# Altium schematic sheet CONNECTORS2.SchDoc
size A; SheetNumber: 4; SheetTotal: 7
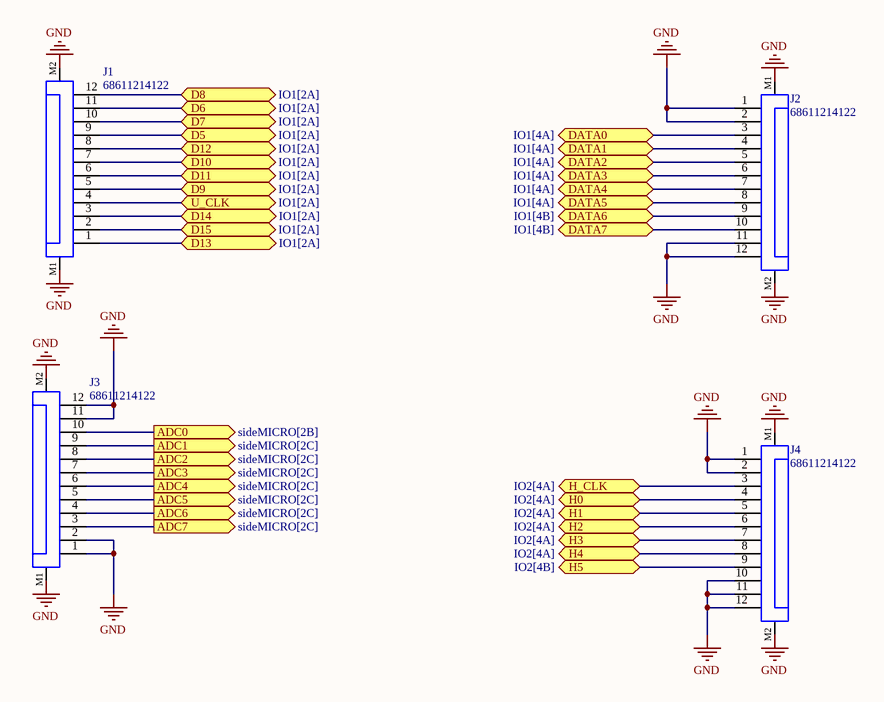
[diagram p0: CONNECTORS2.SchDoc]

## Parts
J1  68611214122  [68611214122]
J2  68611214122  [68611214122]
J3  68611214122  [68611214122]
J4  68611214122  [68611214122]

## Ports
ADC0 (out, see sideMICRO[2B]), ADC1 (out, see sideMICRO[2C]), ADC2 (out, see sideMICRO[2C]), ADC3 (out, see sideMICRO[2C]), ADC4 (out, see sideMICRO[2C]), ADC5 (out, see sideMICRO[2C]), ADC6 (out, see sideMICRO[2C]), ADC7 (out, see sideMICRO[2C]), D5 (bidir, see IO1[2A]), D6 (bidir, see IO1[2A]), D7 (bidir, see IO1[2A]), D8 (bidir, see IO1[2A]), D9 (bidir, see IO1[2A]), D10 (bidir, see IO1[2A]), D11 (bidir, see IO1[2A]), D12 (bidir, see IO1[2A]), D13 (bidir, see IO1[2A]), D14 (bidir, see IO1[2A]), D15 (bidir, see IO1[2A]), DATA0 (bidir, see IO1[4A]), DATA1 (bidir, see IO1[4A]), DATA2 (bidir, see IO1[4A]), DATA3 (bidir, see IO1[4A]), DATA4 (bidir, see IO1[4A]), DATA5 (bidir, see IO1[4A]), DATA6 (bidir, see IO1[4B]), DATA7 (bidir, see IO1[4B]), H0 (bidir, see IO2[4A]), H1 (bidir, see IO2[4A]), H2 (bidir, see IO2[4A]), H3 (bidir, see IO2[4A]), H4 (bidir, see IO2[4A]), H5 (bidir, see IO2[4B]), H_CLK (bidir, see IO2[4A]), U_CLK (bidir, see IO1[2A])

## Nets
GND: J1.M1 J1.M2 J2.1 J2.2 J2.11 J2.12 J2.M1 J2.M2 J3.1 J3.2 J3.11 J3.12 J3.M1 J3.M2 J4.1 J4.2 J4.10 J4.11 J4.12 J4.M1 J4.M2
ADC0: J3.10 ; port ADC0
ADC1: J3.9 ; port ADC1
ADC2: J3.8 ; port ADC2
ADC3: J3.7 ; port ADC3
ADC4: J3.6 ; port ADC4
ADC5: J3.5 ; port ADC5
ADC6: J3.4 ; port ADC6
ADC7: J3.3 ; port ADC7
D5: J1.9 ; port D5
D6: J1.11 ; port D6
D7: J1.10 ; port D7
D8: J1.12 ; port D8
D9: J1.5 ; port D9
D10: J1.7 ; port D10
D11: J1.6 ; port D11
D12: J1.8 ; port D12
D13: J1.1 ; port D13
D14: J1.3 ; port D14
D15: J1.2 ; port D15
DATA0: J2.3 ; port DATA0
DATA1: J2.4 ; port DATA1
DATA2: J2.5 ; port DATA2
DATA3: J2.6 ; port DATA3
DATA4: J2.7 ; port DATA4
DATA5: J2.8 ; port DATA5
DATA6: J2.9 ; port DATA6
DATA7: J2.10 ; port DATA7
H0: J4.4 ; port H0
H1: J4.5 ; port H1
H2: J4.6 ; port H2
H3: J4.7 ; port H3
H4: J4.8 ; port H4
H5: J4.9 ; port H5
H_CLK: J4.3 ; port H_CLK
U_CLK: J1.4 ; port U_CLK

## Library data of the parts
J1-J4 = CMP-1502-01473-2: NexarPartId: 8917683; Actuator Material: Polyphenylene; Operating Supply Voltage: 125V; Number of Contacts: 12; Contact Resistance: 20mΩ; Gender: Male; Current Rating: 1A; Insulation Resistance: 100MΩ; Pitch: 1mm; Number of Rows: 1; Number of Pins: 12; REACH SVHC: Unknown; Flammability Rating: UL94 V-0; Packaging: Tape and Reel; Voltage Rating: 125V; Contact Plating: Tin; Number of Positions: 12; RoHS: Compliant; Min Operating Temperature: -25°C; Termination: Solder; Contact Material: Bronze, Tin; Lead Pitch: 1mm; Mount: Surface Mount; Width: 2.95mm; Max Operating Temperature: 85°C; Orientation: Horizontal; Length: 19mm; Housing Material: Polyphenylene